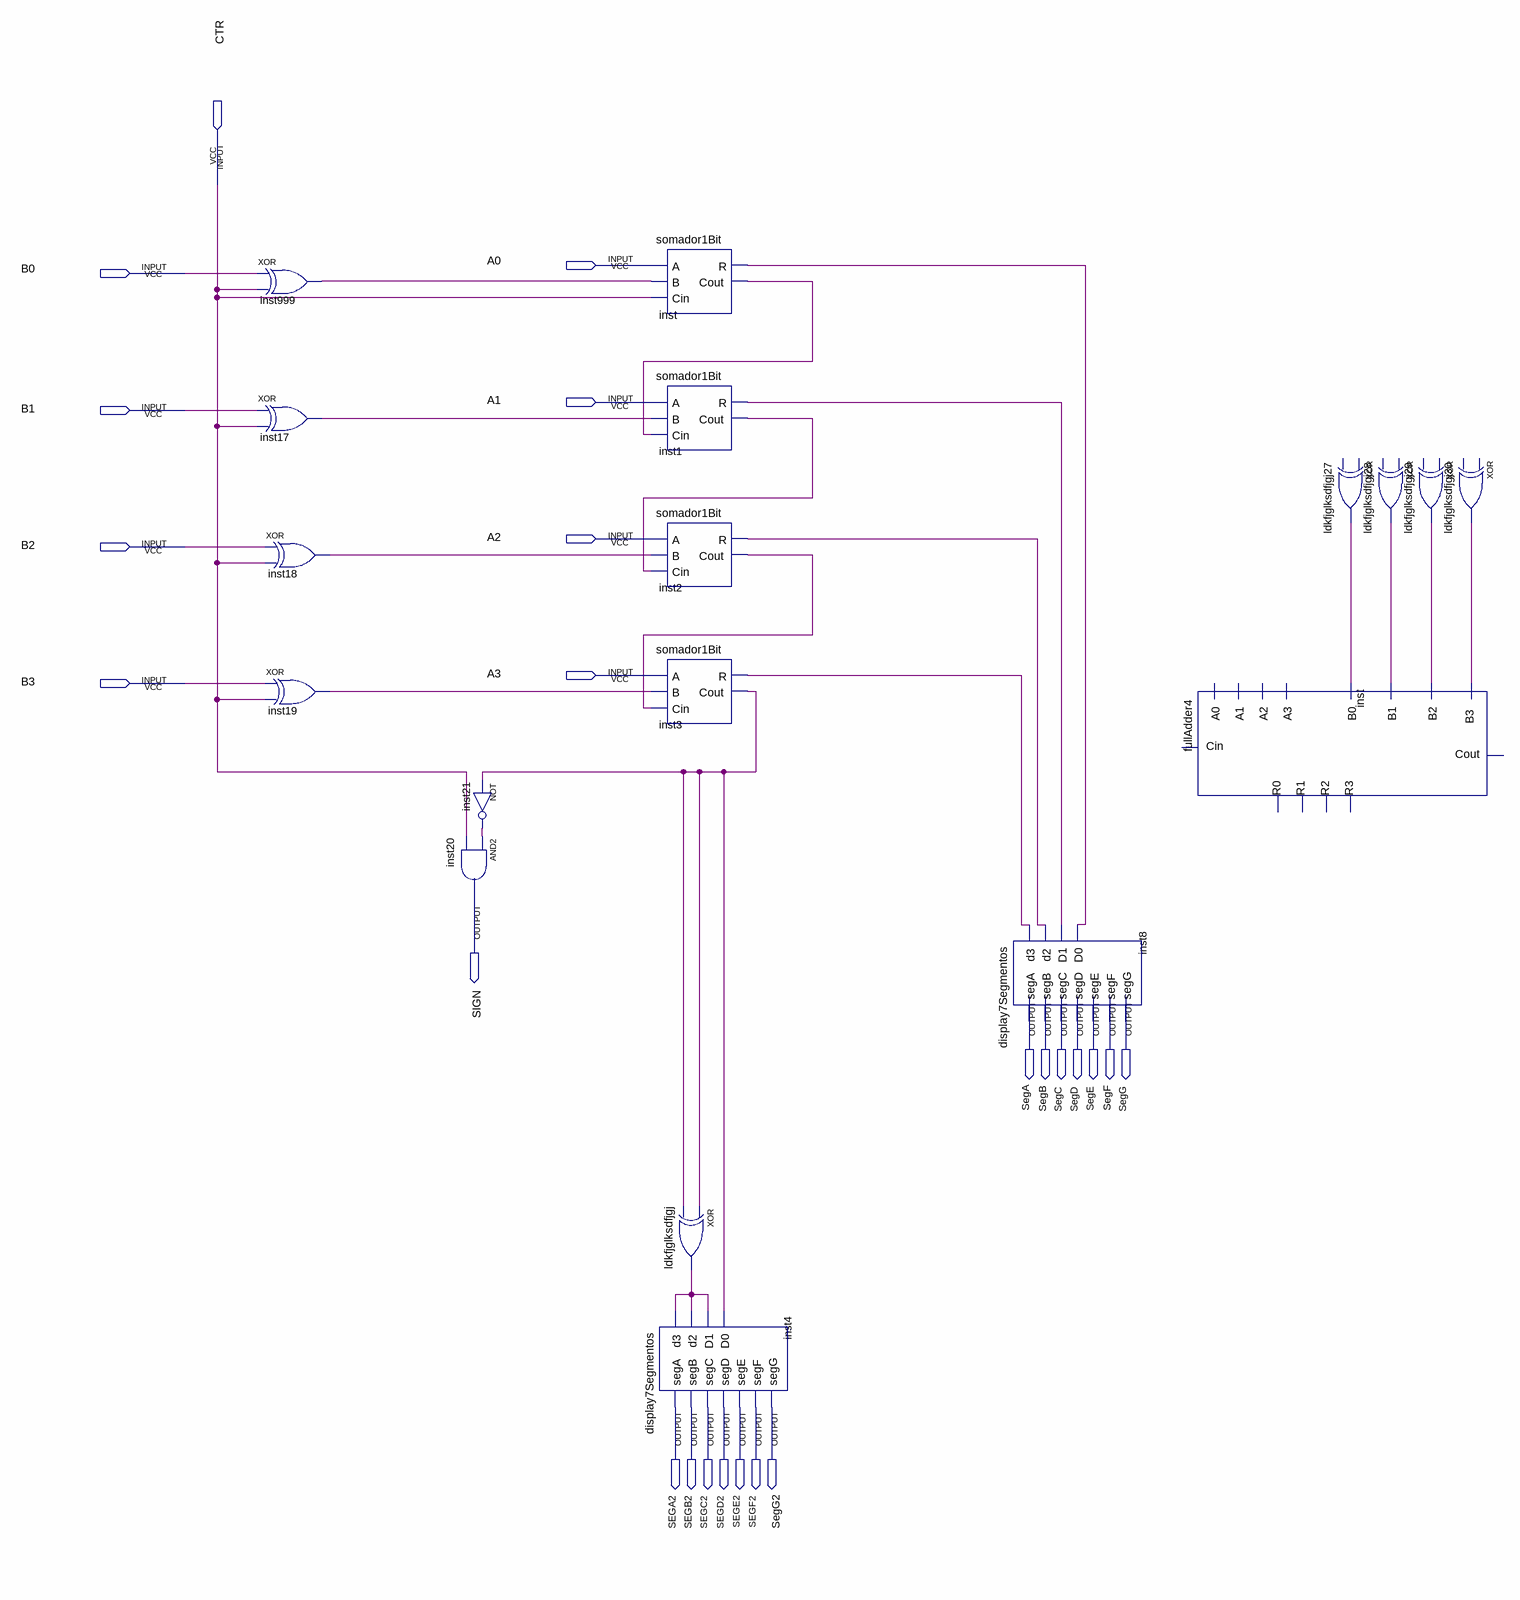
[diagram p0: schematic sheet]
// Quartus schematic somador4Bits.bdf as structural Verilog: 18 symbols, 24 pins
module somador4Bits (
  input  CTR,
  input  A0,
  input  B0,
  input  A1,
  input  B1,
  input  A2,
  input  B2,
  input  A3,
  input  B3,
  output SIGN,
  output SegA,
  output SegB,
  output SegC,
  output SegD,
  output SegE,
  output SegF,
  output SegG,
  output SEGA2,
  output SEGB2,
  output SEGC2,
  output SEGD2,
  output SEGE2,
  output SEGF2,
  output SegG2
);

  wire inst1_cout, inst1_r, inst2_cout, inst2_r, inst3_cout, inst3_r, inst17_out, inst18_out, inst19_out,
       inst21_out, inst999_out, inst_cout, inst_r, ldkfjglksdfjgj27_out, ldkfjglksdfjgj28_out,
       ldkfjglksdfjgj29_out, ldkfjglksdfjgj30_out, ldkfjglksdfjgj_out;

  xor inst999 (inst999_out, B0, CTR);
  xor inst17 (inst17_out, B1, CTR);
  xor inst18 (inst18_out, B2, CTR);
  xor inst19 (inst19_out, B3, CTR);
  not inst21 (inst21_out, inst3_cout);
  and inst20 (SIGN, inst21_out, CTR);
  somador1Bit inst (.A(A0), .B(inst999_out), .Cin(CTR), .R(inst_r), .Cout(inst_cout));
  somador1Bit inst1 (.A(A1), .B(inst17_out), .Cin(inst_cout), .R(inst1_r), .Cout(inst1_cout));
  somador1Bit inst2 (.A(A2), .B(inst18_out), .Cin(inst1_cout), .R(inst2_r), .Cout(inst2_cout));
  somador1Bit inst3 (.A(A3), .B(inst19_out), .Cin(inst2_cout), .R(inst3_r), .Cout(inst3_cout));
  xor ldkfjglksdfjgj (ldkfjglksdfjgj_out, inst3_cout, inst3_cout);
  display7Segmentos inst4 (
    .d3(ldkfjglksdfjgj_out), .d2(ldkfjglksdfjgj_out), .D1(ldkfjglksdfjgj_out), .D0(inst3_cout), .segA(SEGA2),
    .segB(SEGB2), .segC(SEGC2), .segD(SEGD2), .segE(SEGE2), .segF(SEGF2), .segG(SegG2));
  display7Segmentos inst8 (
    .d3(inst3_r), .d2(inst2_r), .D1(inst1_r), .D0(inst_r), .segA(SegA), .segB(SegB), .segC(SegC),
    .segD(SegD), .segE(SegE), .segF(SegF), .segG(SegG));
  fullAdder4 inst_dup2 (
    .B0(ldkfjglksdfjgj27_out), .B1(ldkfjglksdfjgj28_out), .B2(ldkfjglksdfjgj29_out), .B3(ldkfjglksdfjgj30_out));  // open: A0, Cin, A1, A2, A3, R0, R1, R2, R3, Cout
  // XOR ldkfjglksdfjgj27 has open pins: IN1=open, IN2=open, OUT=ldkfjglksdfjgj27_out
  // XOR ldkfjglksdfjgj28 has open pins: IN1=open, IN2=open, OUT=ldkfjglksdfjgj28_out
  // XOR ldkfjglksdfjgj29 has open pins: IN1=open, IN2=open, OUT=ldkfjglksdfjgj29_out
  // XOR ldkfjglksdfjgj30 has open pins: IN1=open, IN2=open, OUT=ldkfjglksdfjgj30_out
endmodule
